# Altium schematic sheet top.SchDoc
size A4
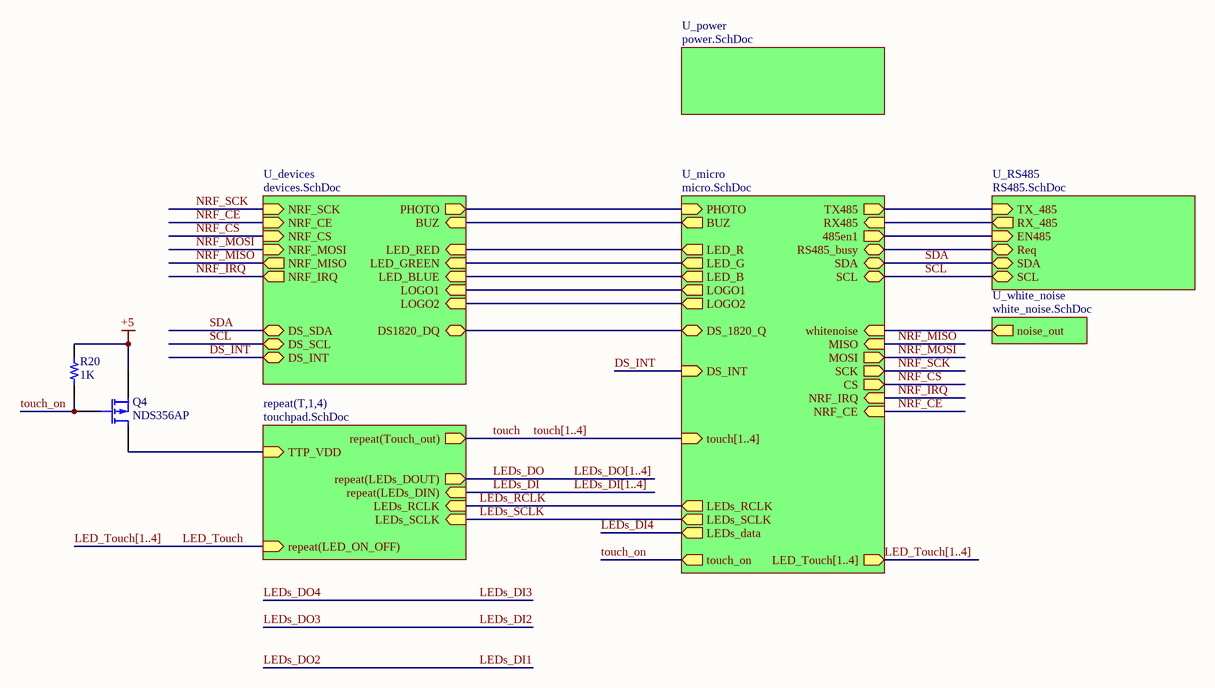
[diagram p0: top.SchDoc]

## Parts
Q4  NDS356AP  [soT95p280x130-3n]
R20  1K  [0603R]

## Sub-sheets
repeat(T,1,4) = touchpad.SchDoc: TTP_VDD (in), repeat(Touch_out) (out), repeat(LEDs_DIN) (in), repeat(LEDs_DOUT) (out), LEDs_RCLK (in), LEDs_SCLK (in), repeat(LED_ON_OFF) (in)
U_devices = devices.SchDoc: NRF_MISO (out), NRF_SCK (in), NRF_CE (in), NRF_IRQ (out), NRF_CS (in), NRF_MOSI (in), BUZ (in), PHOTO (out), DS_SCL (bidir), DS_SDA (bidir), DS_INT (bidir), DS1820_DQ (bidir), LED_RED (in), LED_GREEN (in), LED_BLUE (in), LOGO1 (in), LOGO2 (in)
U_micro = micro.SchDoc: whitenoise (in), SCL (bidir), SDA (bidir), RX485 (in), TX485 (out), 485en1 (out), RS485_busy (bidir), MISO (in), LED_G (out), SCK (out), NRF_CE (in), LED_B (out), NRF_IRQ (in), DS_1820_Q (bidir), PHOTO (in), DS_INT (in), LED_R (out), MOSI (out), CS (out), BUZ (out), touch_on (out), LEDs_RCLK (out), LEDs_SCLK (out), LEDs_data (out), touch[1..4] (in), LED_Touch[1..4] (out), LOGO1 (out), LOGO2 (out)
U_power = power.SchDoc: no entries
U_RS485 = RS485.SchDoc: RX_485 (out), EN485 (in), TX_485 (in), Req (bidir), SDA (bidir), SCL (bidir)
U_white_noise = white_noise.SchDoc: noise_out (out)

## Nets
+5: Q4.3(S) R20.1
DS_INT: sheet U_micro/DS_INT, sheet U_devices/DS_INT
LED_Touch: sheet repeat(T,1,4)/repeat(LED_ON_OFF)
LEDs_DI: sheet repeat(T,1,4)/repeat(LEDs_DIN)
LEDs_DI4: sheet U_micro/LEDs_data
LEDs_DO: sheet repeat(T,1,4)/repeat(LEDs_DOUT)
LEDs_RCLK: sheet U_micro/LEDs_RCLK, sheet repeat(T,1,4)/LEDs_RCLK
LEDs_SCLK: sheet U_micro/LEDs_SCLK, sheet repeat(T,1,4)/LEDs_SCLK
NRF_CE: sheet U_micro/NRF_CE, sheet U_devices/NRF_CE
NRF_CS: sheet U_micro/CS, sheet U_devices/NRF_CS
NRF_IRQ: sheet U_micro/NRF_IRQ, sheet U_devices/NRF_IRQ
NRF_MISO: sheet U_micro/MISO, sheet U_devices/NRF_MISO
NRF_MOSI: sheet U_micro/MOSI, sheet U_devices/NRF_MOSI
NRF_SCK: sheet U_micro/SCK, sheet U_devices/NRF_SCK
SCL: sheet U_micro/SCL, sheet U_RS485/SCL, sheet U_devices/DS_SCL
SDA: sheet U_micro/SDA, sheet U_RS485/SDA, sheet U_devices/DS_SDA
touch: sheet repeat(T,1,4)/repeat(Touch_out)  [also labelled touch[1..4]]
touch_on: Q4.2(G) R20.2 ; sheet U_micro/touch_on
NetQ4_1: Q4.1(D) ; sheet repeat(T,1,4)/TTP_VDD
(unnamed): sheet U_micro/whitenoise, sheet U_white_noise/noise_out
(unnamed): sheet U_micro/RX485, sheet U_RS485/RX_485
(unnamed): sheet U_micro/TX485, sheet U_RS485/TX_485
(unnamed): sheet U_micro/485en1, sheet U_RS485/EN485
(unnamed): sheet U_micro/RS485_busy, sheet U_RS485/Req
(unnamed): sheet U_micro/LED_G, sheet U_devices/LED_GREEN
(unnamed): sheet U_micro/LED_B, sheet U_devices/LED_BLUE
(unnamed): sheet U_micro/DS_1820_Q, sheet U_devices/DS1820_DQ
(unnamed): sheet U_micro/PHOTO, sheet U_devices/PHOTO
(unnamed): sheet U_micro/LED_R, sheet U_devices/LED_RED
(unnamed): sheet U_micro/BUZ, sheet U_devices/BUZ
(unnamed): sheet U_micro/LOGO1, sheet U_devices/LOGO1
(unnamed): sheet U_micro/LOGO2, sheet U_devices/LOGO2

## Buses and harness runs
bus LED_Touch[1..4]
bus LED_Touch[1..4] = sheet U_micro/LED_Touch[1..4]
bus LEDs_DI[1..4]
bus LEDs_DO[1..4]

## Library data of the parts
Q4 = MOSFET-P: P-Channel MOSFET SOT23; pin to pad: 1>3 2>1 3>2; Published: 8-Jun-2000; LatestRevisionDate: 17-Jul-2002; LatestRevisionNote: Re-released for DXP Platform.; PackageVersion: 1995/1996; PackageReference: E3; Publisher: Altium Limited; PackageDescription: TO, Flat Index; 3 In-Line, Axial Leads; Body Dia. 4.6mm; Lead Dia. 0.5 mm (max)
R20 = Resistor: RES SMD 0603; Part Number: RCS0805100KFKEA; Value: 1K